# EAGLE schematic led_driver_AL8805 (EAGLE 6.1)
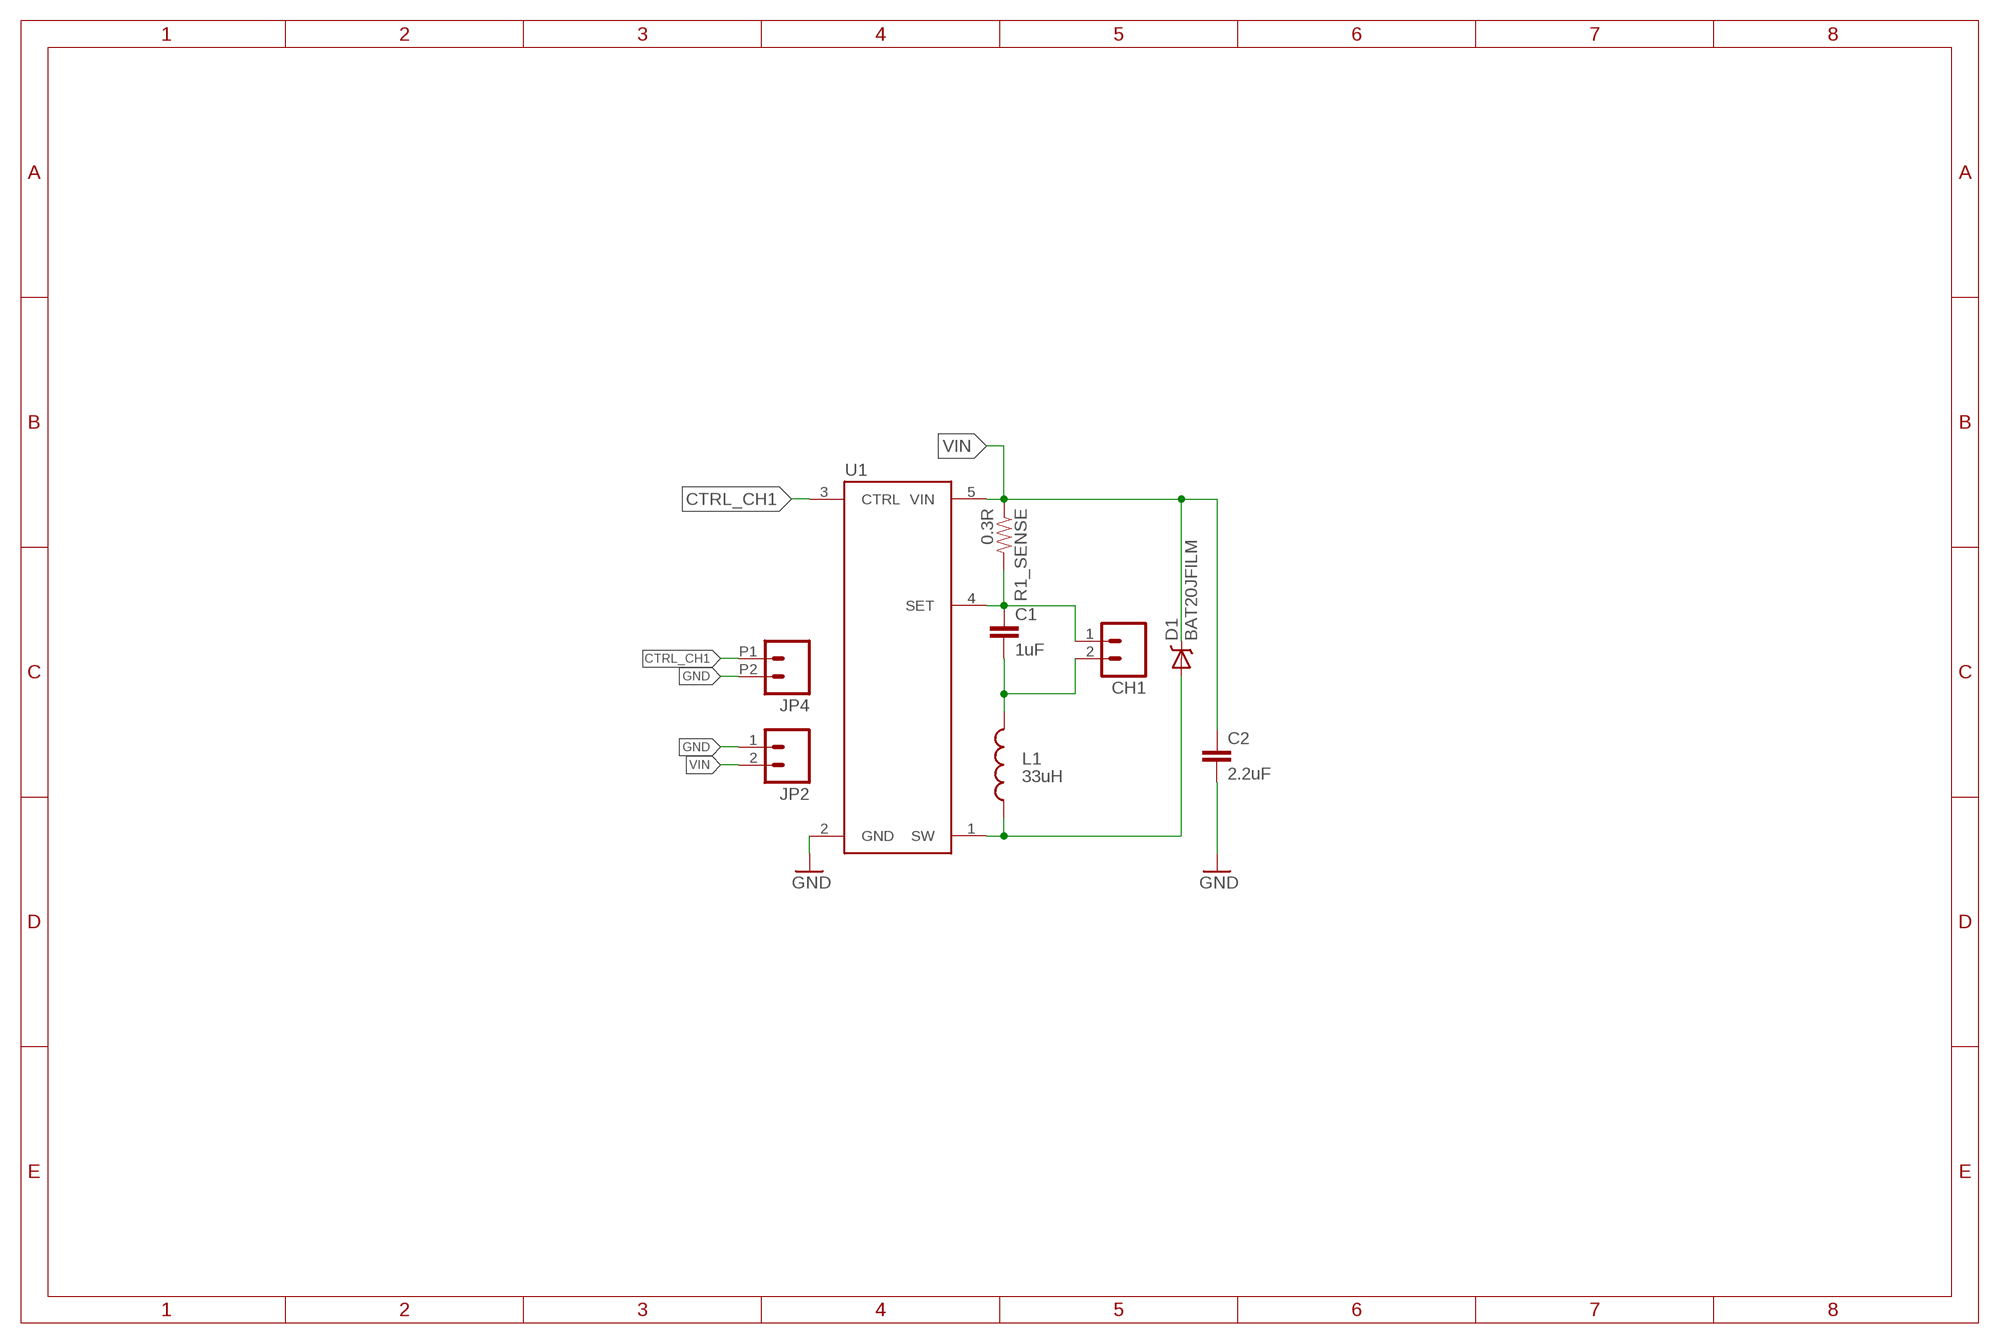
[diagram p0: schematic, sheet 1]

## Parts
C1  1uF  1.0UF-25V-+80/-20(0805)  [0805]
C2  2.2uF  2.2UF-25V-+80/-20(0805)  [0805]
CH1  M023.5MM_LOCK  [SCREWTERMINAL-3.5MM-2_LOCK]
D1  BAT20JFILM  [SOD-323]
JP2  M023.5MM_LOCK  [SCREWTERMINAL-3.5MM-2_LOCK]
JP4  M022.54MM_SCREWTERM  [1X02_2.54_SCREWTERM]
L1  33uH  INDUCTORBOURNS_SRN6045  [SRN6045]
R1_SENSE  0.3R  0.3OHM-1/8W-1%(0805)  [0805]
U1  AL8805  [SOT23-5]

## Nets
CTRL_CH1: JP4.P1 U1.3(CTRL)
GND: C2.2 JP2.1 JP4.P2 U1.2(GND)
IND1-1: D1.2(A) L1.1 U1.1(SW)
N$5 [power]: C1.2 CH1.2 L1.2
N$11: C1.1 CH1.1 R1_SENSE.2 U1.4(SET)
VIN: C2.1 D1.1(C) JP2.2 R1_SENSE.1 U1.5(VIN)

## Library data of the parts
C1 = SparkFun-Capacitors:1.0UF-25V-+80/-20(0805); PROD_ID: CAP-11625; VALUE: 1.0uF
C2 = SparkFun-Capacitors:2.2UF-25V-+80/-20(0805); PROD_ID: CAP-11624
CH1 JP2 = SparkFun:M02: Header 2 Standard 2-pin 0.1" header. Use with straight break away headers (SKU : PRT-00116), right angle break away headers (PRT-00553), swiss pins (PRT-00743), machine pins (PRT-00117), and female headers (PRT-00115). Molex polarized connector foot print use with SKU : PRT-08233 with associated crimp pins and housings.
D1 = SparkFun-DiscreteSemi:BAT20JFILM: 23V, 1A Schottky diode, SOD-323 package; PROD_ID: DIO-11623
JP4 = SparkFun-Connectors:M02: Standard 2-pin 0.1" header. Use with - straight break away headers ( PRT-00116) - right angle break away headers (PRT-00553) - swiss pins (PRT-00743) - machine pins (PRT-00117) - female headers (PRT-00115) Molex polarized connector foot print use with: PRT-08233 with associated crimp pins and housings. 2.54_SCREWTERM for use with PRT-10571. 3.5mm Screw Terminal footprints for PRT-08084 5mm Screw Terminal footprints for use with PRT-08433
L1 = SparkFun-Passives:INDUCTOR: Inductors Basic Inductor/Choke - 0603 and 1206. Footprints are not proven and vary greatly between part numbers. SRN6045- 33uH, 20% 1.4A; PROD_ID: NDUC-11627
R1_SENSE = SparkFun-Resistors:0.3OHM-1/8W-1%(0805); PROD_ID: RES-11622; VALUE: 0.3
U1 = SparkFun-PowerIC:AL8805: Constant current LED driver PWM-able 1MHz switch freq 6V-36V Up to 1A LED current; PROD_ID: IC-11626; VALUE: AL8805WS

## Net classes
0 default: width 0.254 mm
1 power: width 0.508 mm